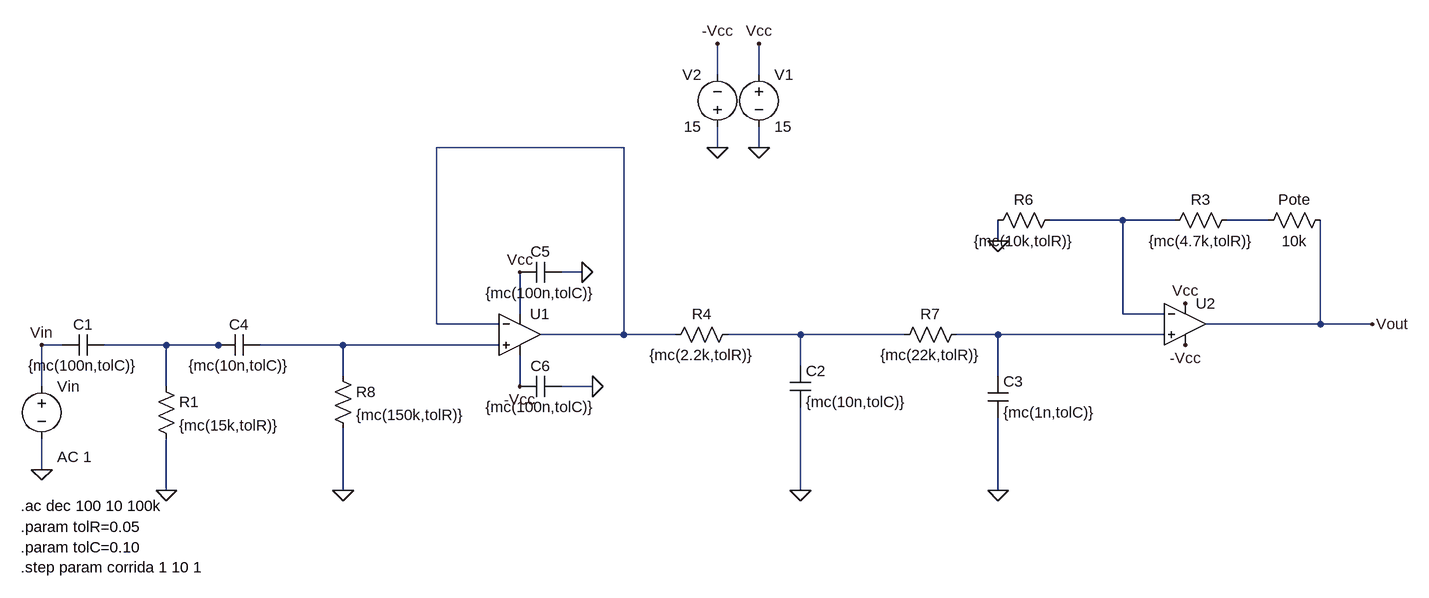
[diagram p0: schematic Filtro_pasa_bandas_200Hz_4K_Hz (3).asc]
Filtro_pasa_bandas_200Hz_4K_Hz (3).asc, the LTspice schematic file:
Version 4.1
SHEET 1 1784 680
WIRE 704 -304 704 -352
WIRE 768 -304 768 -352
WIRE 560 -192 272 -192
WIRE 704 -192 704 -224
WIRE 768 -192 768 -224
WIRE 1328 -80 1216 -80
WIRE 1408 -80 1328 -80
WIRE 1552 -80 1488 -80
WIRE 1136 -48 1136 -80
WIRE 496 0 464 0
WIRE 400 64 400 0
WIRE 1328 64 1328 -80
WIRE 1392 64 1328 64
WIRE 272 80 272 -192
WIRE 368 80 272 80
WIRE 1632 80 1632 -80
WIRE 1632 80 1456 80
WIRE 1712 80 1632 80
WIRE 560 96 560 -192
WIRE 560 96 432 96
WIRE 640 96 560 96
WIRE 832 96 720 96
WIRE 992 96 832 96
WIRE 1136 96 1072 96
WIRE 1392 96 1136 96
WIRE -304 112 -336 112
WIRE -144 112 -240 112
WIRE -64 112 -144 112
WIRE -48 112 -64 112
WIRE 128 112 0 112
WIRE 368 112 128 112
WIRE 832 144 832 96
WIRE 128 160 128 112
WIRE 1136 160 1136 96
WIRE -336 176 -336 112
WIRE -144 176 -144 112
WIRE 400 176 400 128
WIRE 512 176 464 176
WIRE -336 304 -336 256
WIRE -144 336 -144 256
WIRE 128 336 128 240
WIRE 832 336 832 208
WIRE 1136 336 1136 224
FLAG -144 336 0
FLAG 832 336 0
FLAG 1136 -48 0
FLAG 704 -192 0
FLAG 768 -192 0
FLAG 768 -352 Vcc
FLAG 704 -352 -Vcc
FLAG 1424 48 Vcc
FLAG 1424 112 -Vcc
FLAG -336 304 0
FLAG 1712 80 Vout
FLAG -336 112 Vin
FLAG 1136 336 0
FLAG 128 336 0
FLAG 512 176 0
FLAG 496 0 0
FLAG 400 0 Vcc
FLAG 400 176 -Vcc
SYMBOL cap -240 96 R90
WINDOW 0 0 32 VBottom 2
WINDOW 3 32 32 VTop 2
SYMATTR InstName C1
SYMATTR Value {mc(100n,tolC)}
SYMBOL res -160 160 R0
SYMATTR InstName R1
SYMATTR Value {mc(15k,tolR)}
SYMBOL OpAmps\\UniversalOpAmp 400 96 R0
SYMATTR InstName U1
SYMBOL res 736 80 R90
WINDOW 0 0 56 VBottom 2
WINDOW 3 32 56 VTop 2
SYMATTR InstName R4
SYMATTR Value {mc(2.2k,tolR)}
SYMBOL cap 816 144 R0
SYMATTR InstName C2
SYMATTR Value {mc(10n,tolC)}
SYMBOL OpAmps\\UniversalOpAmp 1424 80 R0
SYMATTR InstName U2
SYMBOL res 1232 -96 R90
WINDOW 0 0 56 VBottom 2
WINDOW 3 32 56 VTop 2
SYMATTR InstName R6
SYMATTR Value {mc(10k,tolR)}
SYMBOL voltage 768 -320 R0
SYMATTR InstName V1
SYMATTR Value 15
SYMBOL voltage 704 -208 R180
WINDOW 0 24 96 Left 2
WINDOW 3 24 16 Left 2
SYMATTR InstName V2
SYMATTR Value 15
SYMBOL voltage -336 160 R0
WINDOW 123 24 124 Left 2
WINDOW 39 0 0 Left 0
SYMATTR Value2 AC 1
SYMATTR InstName Vin
SYMATTR Value ""
SYMBOL res 1088 80 R90
WINDOW 0 0 56 VBottom 2
WINDOW 3 32 56 VTop 2
SYMATTR InstName R7
SYMATTR Value {mc(22k,tolR)}
SYMBOL cap 1120 160 R0
SYMATTR InstName C3
SYMATTR Value {mc(1n,tolC)}
SYMBOL cap 0 96 R90
WINDOW 0 0 32 VBottom 2
WINDOW 3 32 32 VTop 2
SYMATTR InstName C4
SYMATTR Value {mc(10n,tolC)}
SYMBOL res 112 144 R0
SYMATTR InstName R8
SYMATTR Value {mc(150k,tolR)}
SYMBOL res 1648 -96 R90
WINDOW 0 0 56 VBottom 2
WINDOW 3 32 56 VTop 2
SYMATTR InstName Pote
SYMATTR Value 10k
SYMBOL res 1504 -96 R90
WINDOW 0 0 56 VBottom 2
WINDOW 3 32 56 VTop 2
SYMATTR InstName R3
SYMATTR Value {mc(4.7k,tolR)}
SYMBOL cap 464 -16 R90
WINDOW 0 0 32 VBottom 2
WINDOW 3 32 32 VTop 2
SYMATTR InstName C5
SYMATTR Value {mc(100n,tolC)}
SYMBOL cap 464 160 R90
WINDOW 0 0 32 VBottom 2
WINDOW 3 32 32 VTop 2
SYMATTR InstName C6
SYMATTR Value {mc(100n,tolC)}
TEXT -368 360 Left 2 !.ac dec 100 10 100k
TEXT -368 392 Left 2 !.param tolR=0.05\n.param tolC=0.10\n.step param corrida 1 10 1

The netlist it stands for:
* Filtro_pasa_bandas_200Hz_4K_Hz (3).asc
C1 N006 Vin {mc(100n,tolC)}
R1 N006 0 {mc(15k,tolR)}
X§U1 N007 N001 Vcc -Vcc N001 level1 Avol=1Meg GBW=10Meg Vos=0 En=0 Enk=0 In=0 Ink=0 Rin=500Meg  ; pins In+ In- V+ V- OUT
R4 N004 N001 {mc(2.2k,tolR)}
C2 N004 0 {mc(10n,tolC)}
X§U2 N005 N002 Vcc -Vcc Vout level1 Avol=1Meg GBW=10Meg Vos=0 En=0 Enk=0 In=0 Ink=0 Rin=500Meg  ; pins In+ In- V+ V- OUT
R6 N002 0 {mc(10k,tolR)}
V1 Vcc 0 15
V2 0 -Vcc 15
Vin Vin 0 AC 1
R7 N005 N004 {mc(22k,tolR)}
C3 N005 0 {mc(1n,tolC)}
C4 N007 N006 {mc(10n,tolC)}
R8 N007 0 {mc(150k,tolR)}
R§Pote Vout N003 10k
R3 N003 N002 {mc(4.7k,tolR)}
C5 0 Vcc {mc(100n,tolC)}
C6 0 -Vcc {mc(100n,tolC)}
.ac dec 100 10 100k
.param tolR=0.05
.param tolC=0.10
.step param corrida 1 10 1
.lib UniversalOpAmp1.lib
.backanno
.end